# EAGLE design RGBcolorsenor_dip-borad (EAGLE 9.4.2)
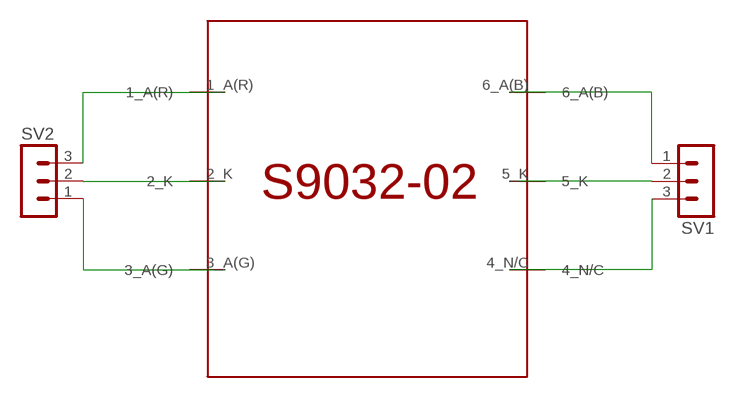
[diagram p0: schematic, sheet 1]

## Parts
SV1  MA03-1  [MA03-1]
SV2  MA03-1  [MA03-1]
U$1  S9032-02  [S9032-02]

## Nets
N$1: SV2.3 U$1.1_A(R)
N$2: SV2.2 U$1.2_K
N$3: SV2.1 U$1.3_A(G)
N$4: SV1.1 U$1.6_A(B)
N$5: SV1.2 U$1.5_K
N$6: SV1.3 U$1.4_N/C

## Library data of the parts
SV1 SV2 = con-lstb:MA03-1: PIN HEADER; OC_FARNELL: unknown; OC_NEWARK: unknown
U$1 = RGBcolorsensor:S9032-02

## Board
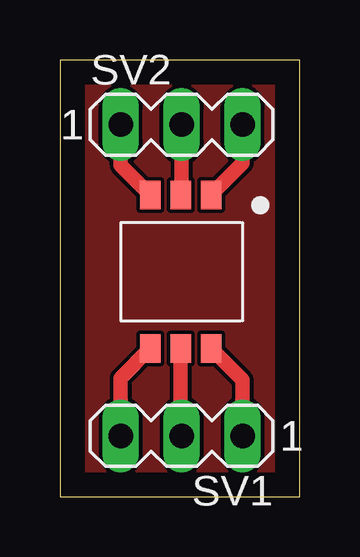
[diagram p1: board, top side]

Size 10 x 18.2 mm. Coordinates in mm from the lower left corner, seen from the top.
Outline: 0,0 10,0 10,18.2 0,18.2 0,0
Copper layers (1*16): Top 0.035mm / dielectric 1.5mm / Bottom 0.035mm
Design rules "default": minimum track width 6mil, minimum drill 0.35mm, track to track 6mil, track to pad 6mil, pad to pad 6mil, via to via 6mil, smd to smd 6mil, copper to edge 40mil, drill to drill 6mil, minimum pad ring 10mil, minimum via ring 8mil, stop-mask expansion 4mil, vias tented up to drill 0mil, thermal gap 10mil

### Footprints (pad centres in the part's own frame; a part is rotated, then mirrored left to right if it is on the bottom)
MA03-1 = drill 1.016 long: 1 -2.54,0; 2 0,0; 3 2.54,0
S9032-02 = smd 1.19 x 0.85: 1_A(R) -1.15,3.77; 2_K -1.15,2.5; 3_A(G) -1.15,1.23; 4_N/C 5.25,1.23; 5_K 5.25,2.5; 6_A(B) 5.25,3.77

### Placement (x,y rotation side)
SV1  5.08,2.54 180 top
SV2  5.08,15.51 0 top
U$1  2.54,11.43 270 top

### Tracks (layer width: path | path; a pad name or v marks a point on that pad's centre or on a via)
AND
  pour Top: 0,18 10,18 10,0 0,0
N$1
  Top 0.61: SV2.3 7.62,13.89 U$1.1_A(R)
N$2
  Top 0.61: SV2.2 5.08,12.62 U$1.2_K
N$3
  Top 0.61: U$1.3_A(G) 2.54,13.81 SV2.1
N$4
  Top 0.61: U$1.6_A(B) 7.62,4.87 SV1.1
N$5
  Top 0.61: U$1.5_K 5.04,2.58 SV1.2
N$6
  Top 0.61: U$1.4_N/C 2.54,4.95 SV1.3